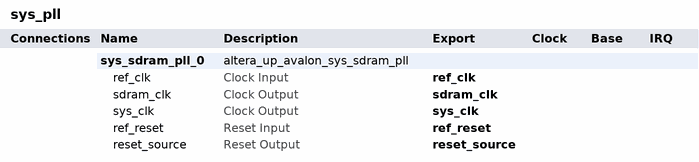
[diagram p0: system contents]
# Platform Designer (Qsys) system sys_pll, Cyclone IV E EP4CE115F29C7
# Parameters at their usual value, and those the tool derives, are not listed.
package require -exact qsys 18.0
create_system sys_pll
set_project_property DEVICE_FAMILY {Cyclone IV E}
set_project_property DEVICE EP4CE115F29C7

add_instance sys_sdram_pll_0 altera_up_avalon_sys_sdram_pll 18.0
set_instance_property sys_sdram_pll_0 AUTO_EXPORT true
set_instance_parameter_value sys_sdram_pll_0 CV_boards DE10-Standard
set_instance_parameter_value sys_sdram_pll_0 gui_outclk 50.0
set_instance_parameter_value sys_sdram_pll_0 gui_refclk 50.0

# exported interfaces
add_interface ref_clk clock sink
set_interface_property ref_clk EXPORT_OF sys_sdram_pll_0.ref_clk
add_interface ref_reset reset sink
set_interface_property ref_reset EXPORT_OF sys_sdram_pll_0.ref_reset
add_interface reset_source reset source
set_interface_property reset_source EXPORT_OF sys_sdram_pll_0.reset_source
add_interface sdram_clk clock source
set_interface_property sdram_clk EXPORT_OF sys_sdram_pll_0.sdram_clk
add_interface sys_clk clock source
set_interface_property sys_clk EXPORT_OF sys_sdram_pll_0.sys_clk

set_interconnect_requirement {$system} qsys_mm.clockCrossingAdapter HANDSHAKE
set_interconnect_requirement {$system} qsys_mm.enableEccProtection FALSE
set_interconnect_requirement {$system} qsys_mm.insertDefaultSlave FALSE
set_interconnect_requirement {$system} qsys_mm.maxAdditionalLatency 1

save_system sys_pll.qsys
